# EAGLE design invader_topplate (EAGLE 9.5.0)
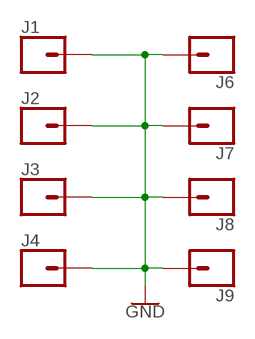
[diagram p0: schematic, sheet 1]

## Parts
J1  CONN_01SPRING-CONN  [SPRING-CONNECTOR]
J2  CONN_01SPRING-CONN  [SPRING-CONNECTOR]
J3  CONN_01SPRING-CONN  [SPRING-CONNECTOR]
J4  CONN_01SPRING-CONN  [SPRING-CONNECTOR]
J6  CONN_01PTH_NO_SILK_KIT  [1X01NS_KIT]
J7  CONN_01PTH_NO_SILK_KIT  [1X01NS_KIT]
J8  CONN_01PTH_NO_SILK_KIT  [1X01NS_KIT]
J9  CONN_01PTH_NO_SILK_KIT  [1X01NS_KIT]

## Nets
GND: J1.P$2 J2.P$2 J3.P$2 J4.P$2 J6.1 J7.1 J8.1 J9.1

## Library data of the parts
J1-J4 = SparkFun-Connectors:CONN_01: Single connection point. Often used as Generic Header-pin footprint for 0.1 inch spaced/style header connections On any of the 0.1 inch spaced packages, you can populate with these: Break Away Headers - Straight <https://www.sparkfun.com/products/116> (PRT-00116) Break Away Male Headers - Right Angle <https://www.sparkfun.com/products/553> (PRT-00553) Female Headers <https://www.sparkfun.com/products/115> (PRT-00115) Break Away Headers - Machine Pin <https://www.sparkfun.com/products/117> (PRT-00117) Break Away Female Headers - Swiss Machine Pin <https://www.sparkfun.com/products/743> (PRT-00743) This device is also useful as a general connection point to wire up your design to another part of your project. Our various solder wires solder well into these plated through hole pads. Hook-Up Wire - Assortment (Stranded, 22 AWG) <https://www.sparkfun.com/products/11375> (PRT-11375) Hook-Up Wire - Assortment (Solid Core, 22 AWG) <https://www.sparkfun.com/products/11367> (PRT-11367) View the entire wire category on our website here <https://www.sparkfun.com/categories/141> Special notes: SMTSO-256-ET is a "flush mount" nut for a 4-40 screw. We mostly use this on specialty testbeds; it is a nice way to connect hardware to your PCB at an adjustable hieght. Also note, the SNAP packages are for using a snappable style connector. We sell a baggie of snaps and they are also used on two LilyPad designs: Snap Assortment - 30 pack (male and female) <https://www.sparkfun.com/products/11347> (DEV-11347) LilyPad Arduino SimpleSnap <https://www.sparkfun.com/products/10941> (DEV-10941) LilyPad SimpleSnap Protoboard <https://www.sparkfun.com/products/10940> (DEV-10940); SF_ID: PRT-11822
J6-J9 = SparkFun-Connectors:CONN_01: Single connection point. Often used as Generic Header-pin footprint for 0.1 inch spaced/style header connections On any of the 0.1 inch spaced packages, you can populate with these: Break Away Headers - Straight <https://www.sparkfun.com/products/116> (PRT-00116) Break Away Male Headers - Right Angle <https://www.sparkfun.com/products/553> (PRT-00553) Female Headers <https://www.sparkfun.com/products/115> (PRT-00115) Break Away Headers - Machine Pin <https://www.sparkfun.com/products/117> (PRT-00117) Break Away Female Headers - Swiss Machine Pin <https://www.sparkfun.com/products/743> (PRT-00743) This device is also useful as a general connection point to wire up your design to another part of your project. Our various solder wires solder well into these plated through hole pads. Hook-Up Wire - Assortment (Stranded, 22 AWG) <https://www.sparkfun.com/products/11375> (PRT-11375) Hook-Up Wire - Assortment (Solid Core, 22 AWG) <https://www.sparkfun.com/products/11367> (PRT-11367) View the entire wire category on our website here <https://www.sparkfun.com/categories/141> Special notes: SMTSO-256-ET is a "flush mount" nut for a 4-40 screw. We mostly use this on specialty testbeds; it is a nice way to connect hardware to your PCB at an adjustable hieght. Also note, the SNAP packages are for using a snappable style connector. We sell a baggie of snaps and they are also used on two LilyPad designs: Snap Assortment - 30 pack (male and female) <https://www.sparkfun.com/products/11347> (DEV-11347) LilyPad Arduino SimpleSnap <https://www.sparkfun.com/products/10941> (DEV-10941) LilyPad SimpleSnap Protoboard <https://www.sparkfun.com/products/10940> (DEV-10940)

## Net classes
0 default: width 0.152 mm
1 VCC: width 0.508 mm

## Board
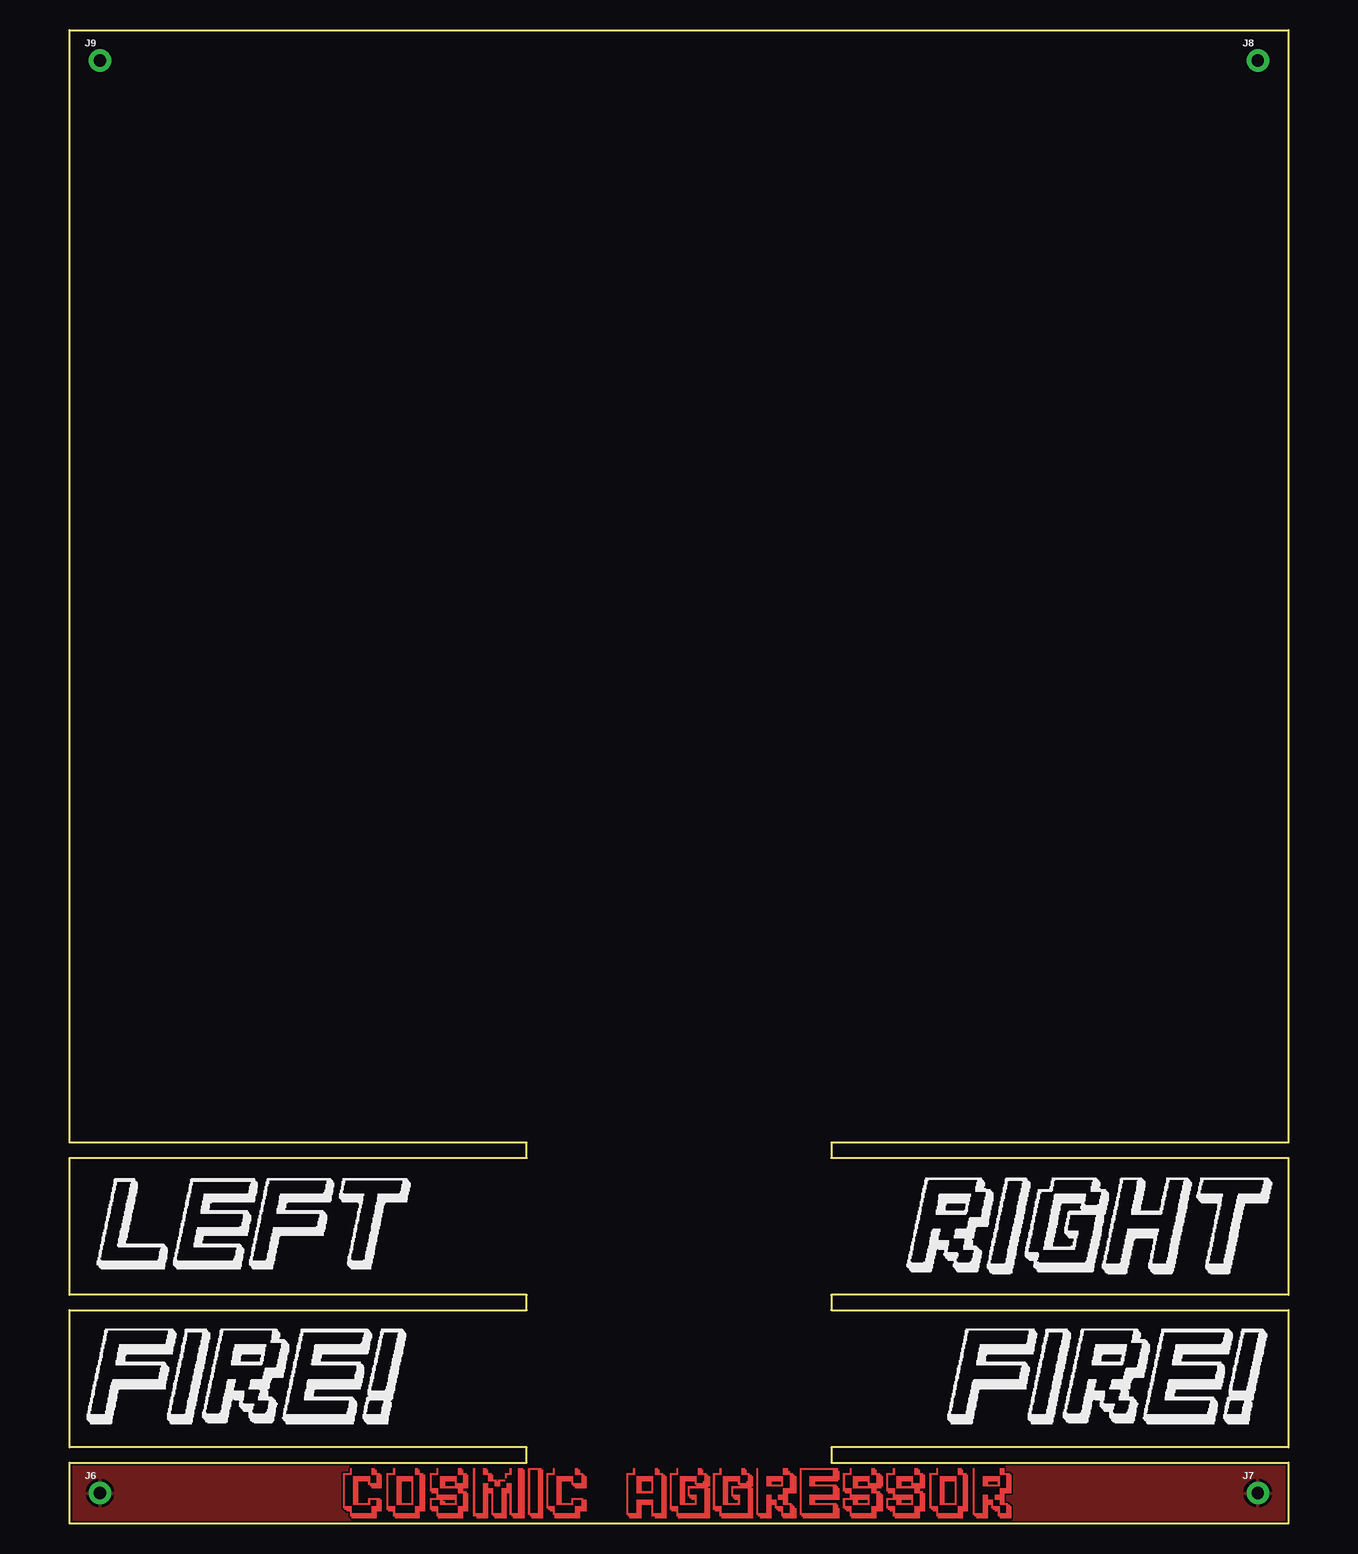
[diagram p1: board, top side]
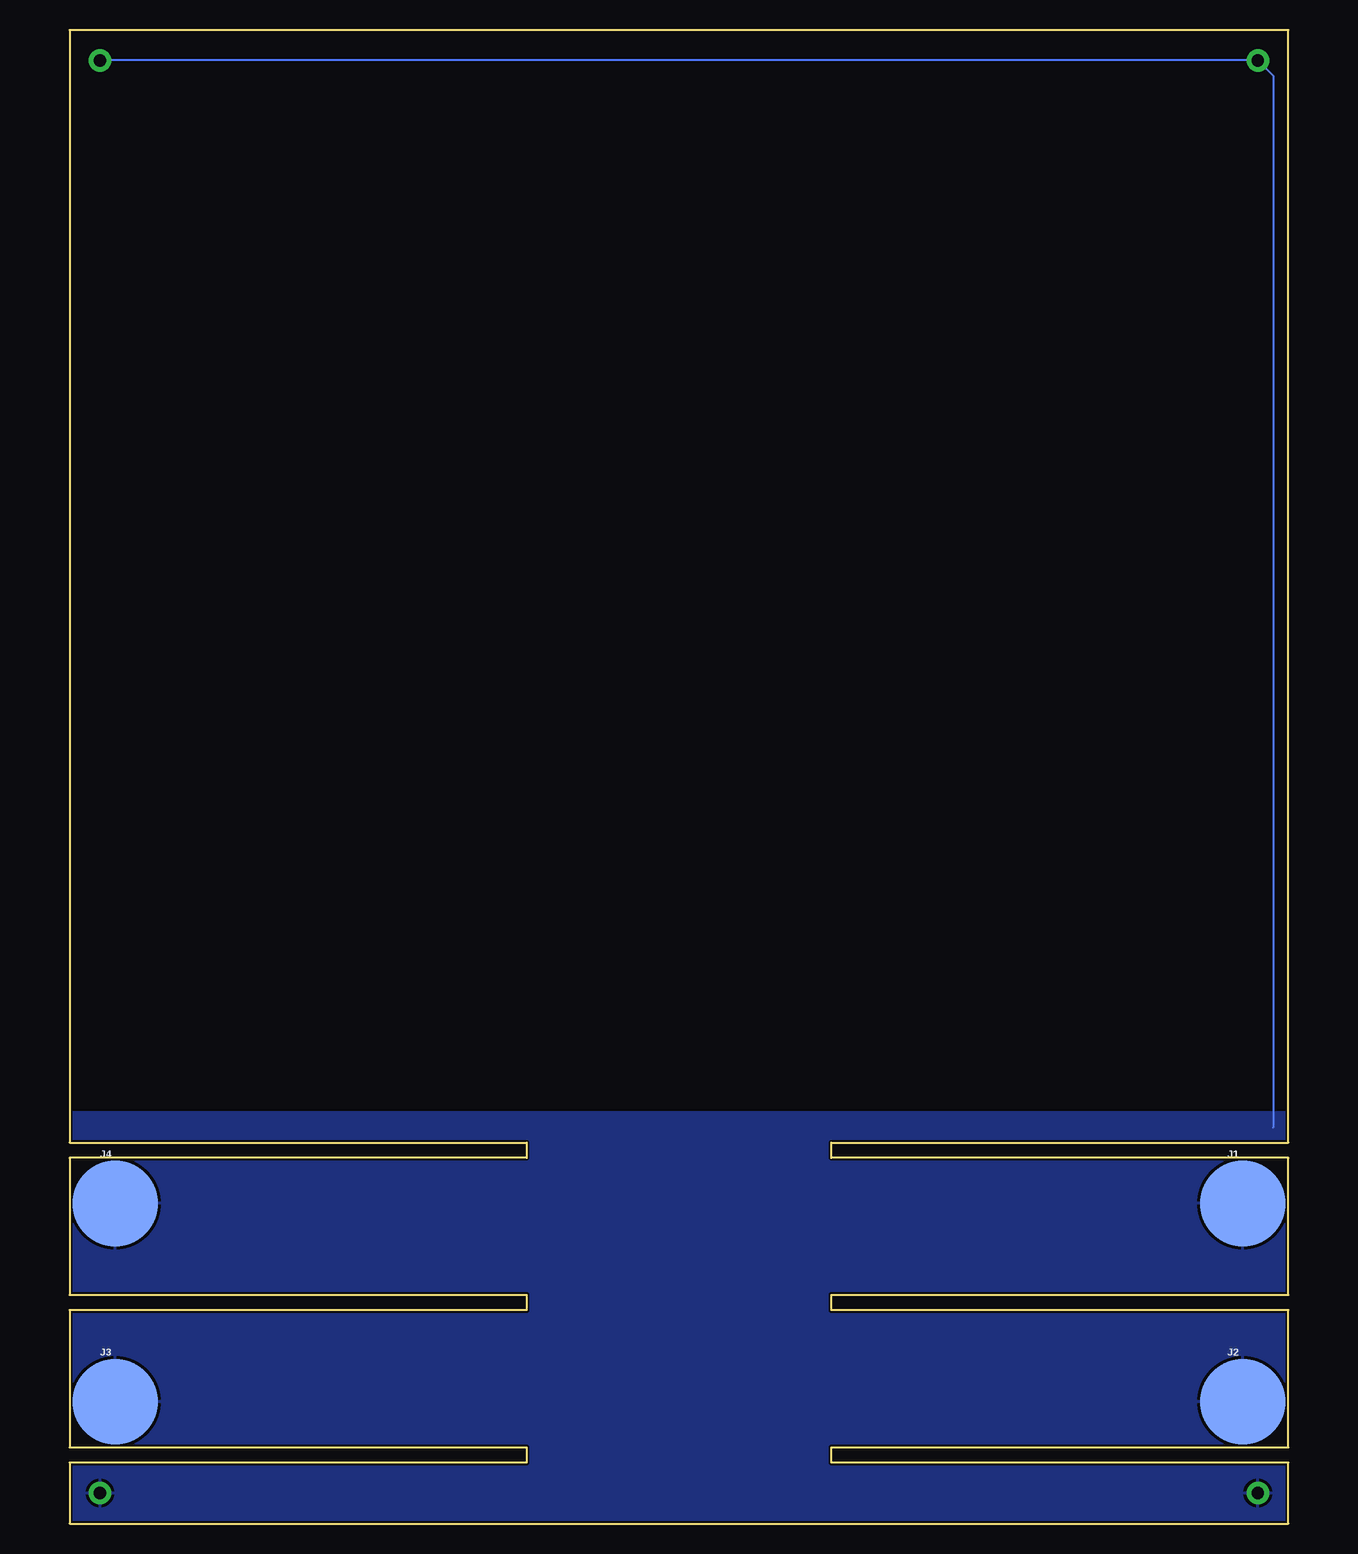
[diagram p2: board, bottom side, seen from below]

Size 101.6 x 124.46 mm. Coordinates in mm from the lower left corner, seen from the top.
Outline: 0,0 0,5.08 38.1,5.08 38.1,6.35 0,6.35 0,17.78 38.1,17.78 38.1,19.05 0,19.05 0,30.48 38.1,30.48 38.1,31.75 0,31.75 0,124.46 101.6,124.46 101.6,31.75 63.5,31.75 63.5,30.48 101.6,30.48 101.6,19.05 63.5,19.05 63.5,17.78 101.6,17.78 101.6,6.35 63.5,6.35 63.5,5.08 101.6,5.08 101.6,0 0,0
Copper layers (1*16): Top 0.035mm / dielectric 1.5mm / Bottom 0.035mm
Design rules "SparkFun-2-layer-PCBWay-LIMIT": minimum track width 6mil, minimum drill 0.3mm, track to track 6mil, track to pad 6mil, pad to pad 6mil, via to via 6mil, smd to smd 6mil, copper to edge 6mil, drill to drill 6mil, minimum pad ring 6mil, minimum via ring 6mil, stop-mask expansion 4mil, vias tented up to drill 25mil, thermal gap 10mil

### Footprints (pad centres in the part's own frame; a part is rotated, then mirrored left to right if it is on the bottom)
SPRING-CONNECTOR = smd 7.112 x 7.112: P$2 0,0
1X01NS_KIT = drill 1.016 pad 1.88: 1 0,0

### Placement (x,y rotation side)
J1  3.81,26.67 0 bottom
J2  3.81,10.16 0 bottom
J3  97.79,10.16 0 bottom
J4  97.79,26.67 0 bottom
J6  2.54,2.54 0 top
J7  99.06,2.54 0 top
J8  99.06,121.92 0 top
J9  2.54,121.92 0 top
U$1  [INVADER_SMALL]  6.35,118.11 0 top
U$2  [FIRE#PNG]  14.61,12.19 0 top
U$3  [INVADER_SMALL]  19.05,118.11 0 top
U$4  [INVADER_SMALL]  6.35,107.95 0 top
U$5  [INVADER_SMALL]  19.05,107.95 0 top
U$6  [INVADER_SMALL]  31.75,107.95 0 top
U$7  [INVADER_SMALL]  44.45,107.95 0 top
U$8  [INVADER_SMALL]  57.15,107.95 0 top
U$9  [INVADER_SMALL]  69.85,107.95 0 top
U$10  [INVADER_SMALL]  82.55,107.95 0 top
U$11  [INVADER_SMALL]  95.25,107.95 0 top
U$12  [BEAM_SMALL]  6.35,102.87 0 top
U$13  [BEAM_SMALL]  19.05,102.87 0 top
U$14  [BEAM_SMALL]  31.75,102.87 0 top
U$15  [BEAM_SMALL]  44.45,102.87 0 top
U$16  [BEAM_SMALL]  57.15,102.87 0 top
U$17  [BEAM_SMALL]  69.85,102.87 0 top
U$18  [BEAM_SMALL]  82.55,102.87 0 top
U$19  [BEAM_SMALL]  95.25,102.87 0 top
U$20  [INVADER_SMALL]  31.75,118.11 0 top
U$21  [INVADER_SMALL]  44.45,118.11 0 top
U$22  [INVADER_SMALL]  57.15,118.11 0 top
U$23  [INVADER_SMALL]  69.85,118.11 0 top
U$24  [INVADER_SMALL]  82.55,118.11 0 top
U$25  [INVADER_SMALL]  95.25,118.11 0 top
U$26  [BEAM_SMALL]  6.35,113.03 0 top
U$27  [BEAM_SMALL]  19.05,113.03 0 top
U$28  [BEAM_SMALL]  31.75,113.03 0 top
U$29  [BEAM_SMALL]  44.45,113.03 0 top
U$30  [BEAM_SMALL]  57.15,113.03 0 top
U$31  [BEAM_SMALL]  69.85,113.03 0 top
U$32  [BEAM_SMALL]  82.55,113.03 0 top
U$33  [BEAM_SMALL]  95.25,113.03 0 top
U$34  [INVADER_SMALL]  6.35,87.63 0 top
U$35  [INVADER_SMALL]  19.05,87.63 0 top
U$36  [INVADER_SMALL]  31.75,87.63 0 top
U$37  [INVADER_SMALL]  44.45,87.63 0 top
U$38  [INVADER_SMALL]  57.15,87.63 0 top
U$39  [INVADER_SMALL]  69.85,87.63 0 top
U$40  [INVADER_SMALL]  82.55,87.63 0 top
U$41  [INVADER_SMALL]  95.25,87.63 0 top
U$42  [BEAM_SMALL]  6.35,82.55 0 top
U$43  [BEAM_SMALL]  19.05,82.55 0 top
U$44  [BEAM_SMALL]  31.75,82.55 0 top
U$45  [BEAM_SMALL]  44.45,82.55 0 top
U$46  [BEAM_SMALL]  57.15,82.55 0 top
U$47  [BEAM_SMALL]  69.85,82.55 0 top
U$48  [BEAM_SMALL]  82.55,82.55 0 top
U$49  [BEAM_SMALL]  95.25,82.55 0 top
U$50  [INVADER_SMALL]  6.35,97.79 0 top
U$51  [INVADER_SMALL]  19.05,97.79 0 top
U$52  [INVADER_SMALL]  31.75,97.79 0 top
U$53  [INVADER_SMALL]  44.45,97.79 0 top
U$54  [INVADER_SMALL]  57.15,97.79 0 top
U$55  [INVADER_SMALL]  69.85,97.79 0 top
U$56  [INVADER_SMALL]  82.55,97.79 0 top
U$57  [INVADER_SMALL]  95.25,97.79 0 top
U$58  [BEAM_SMALL]  6.35,92.71 0 top
U$59  [BEAM_SMALL]  19.05,92.71 0 top
U$60  [BEAM_SMALL]  31.75,92.71 0 top
U$61  [BEAM_SMALL]  44.45,92.71 0 top
U$62  [BEAM_SMALL]  57.15,92.71 0 top
U$63  [BEAM_SMALL]  69.85,92.71 0 top
U$64  [BEAM_SMALL]  82.55,92.71 0 top
U$65  [BEAM_SMALL]  95.25,92.71 0 top
U$66  [INVADER_SMALL]  6.35,67.31 0 top
U$67  [INVADER_SMALL]  19.05,67.31 0 top
U$68  [INVADER_SMALL]  31.75,67.31 0 top
U$69  [INVADER_SMALL]  44.45,67.31 0 top
U$70  [INVADER_SMALL]  57.15,67.31 0 top
U$71  [INVADER_SMALL]  69.85,67.31 0 top
U$72  [INVADER_SMALL]  82.55,67.31 0 top
U$73  [INVADER_SMALL]  95.25,67.31 0 top
U$74  [BEAM_SMALL]  6.35,62.23 0 top
U$75  [BEAM_SMALL]  19.05,62.23 0 top
U$76  [BEAM_SMALL]  31.75,62.23 0 top
U$77  [BEAM_SMALL]  44.45,62.23 0 top
U$78  [BEAM_SMALL]  57.15,62.23 0 top
U$79  [BEAM_SMALL]  69.85,62.23 0 top
U$80  [BEAM_SMALL]  82.55,62.23 0 top
U$81  [BEAM_SMALL]  95.25,62.23 0 top
U$82  [INVADER_SMALL]  6.35,77.47 0 top
U$83  [INVADER_SMALL]  19.05,77.47 0 top
U$84  [INVADER_SMALL]  31.75,77.47 0 top
U$85  [INVADER_SMALL]  44.45,77.47 0 top
U$86  [INVADER_SMALL]  57.15,77.47 0 top
U$87  [INVADER_SMALL]  69.85,77.47 0 top
U$88  [INVADER_SMALL]  82.55,77.47 0 top
U$89  [INVADER_SMALL]  95.25,77.47 0 top
U$90  [BEAM_SMALL]  6.35,72.39 0 top
U$91  [BEAM_SMALL]  19.05,72.39 0 top
U$92  [BEAM_SMALL]  31.75,72.39 0 top
U$93  [BEAM_SMALL]  44.45,72.39 0 top
U$94  [BEAM_SMALL]  57.15,72.39 0 top
U$95  [BEAM_SMALL]  69.85,72.39 0 top
U$96  [BEAM_SMALL]  82.55,72.39 0 top
U$97  [BEAM_SMALL]  95.25,72.39 0 top
U$98  [INVADER_SMALL]  6.35,46.99 0 top
U$99  [INVADER_SMALL]  19.05,46.99 0 top
U$100  [INVADER_SMALL]  31.75,46.99 0 top
U$101  [INVADER_SMALL]  44.45,46.99 0 top
U$102  [INVADER_SMALL]  57.15,46.99 0 top
U$103  [INVADER_SMALL]  69.85,46.99 0 top
U$104  [INVADER_SMALL]  82.55,46.99 0 top
U$105  [INVADER_SMALL]  95.25,46.99 0 top
U$106  [BEAM_SMALL]  6.35,41.91 0 top
U$107  [BEAM_SMALL]  19.05,41.91 0 top
U$108  [BEAM_SMALL]  31.75,41.91 0 top
U$109  [BEAM_SMALL]  44.45,41.91 0 top
U$110  [BEAM_SMALL]  57.15,41.91 0 top
U$111  [BEAM_SMALL]  69.85,41.91 0 top
U$112  [BEAM_SMALL]  82.55,41.91 0 top
U$113  [BEAM_SMALL]  95.25,41.91 0 top
U$114  [INVADER_SMALL]  6.35,57.15 0 top
U$115  [INVADER_SMALL]  19.05,57.15 0 top
U$116  [INVADER_SMALL]  31.75,57.15 0 top
U$117  [INVADER_SMALL]  44.45,57.15 0 top
U$118  [INVADER_SMALL]  57.15,57.15 0 top
U$119  [INVADER_SMALL]  69.85,57.15 0 top
U$120  [INVADER_SMALL]  82.55,57.15 0 top
U$121  [INVADER_SMALL]  95.25,57.15 0 top
U$122  [BEAM_SMALL]  6.35,52.07 0 top
U$123  [BEAM_SMALL]  19.05,52.07 0 top
U$124  [BEAM_SMALL]  31.75,52.07 0 top
U$125  [BEAM_SMALL]  44.45,52.07 0 top
U$126  [BEAM_SMALL]  57.15,52.07 0 top
U$127  [BEAM_SMALL]  69.85,52.07 0 top
U$128  [BEAM_SMALL]  82.55,52.07 0 top
U$129  [BEAM_SMALL]  95.25,52.07 0 top
U$130  [BLASTER_SMALL]  6.35,36.83 0 top
U$131  [BLASTER_SMALL]  19.05,36.83 0 top
U$132  [BLASTER_SMALL]  31.75,36.83 0 top
U$133  [BLASTER_SMALL]  44.45,36.83 0 top
U$134  [BLASTER_SMALL]  57.15,36.83 0 top
U$135  [BLASTER_SMALL]  69.85,36.83 0 top
U$136  [BLASTER_SMALL]  82.55,36.83 0 top
U$137  [BLASTER_SMALL]  95.25,36.83 0 top
U$138  [FIRE#PNG]  86.36,12.19 0 top
U$139  [LEFT#PNG]  15.24,24.89 0 top
U$140  [RIGHT#PNG]  85.09,24.77 0 top
U$141  [TITLE#PNG]  50.8,2.54 0 top

### Tracks (layer width: path | path; a pad name or v marks a point on that pad's centre or on a via)
GND
  Bottom 0.152: J8.1 J9.1 1.27,120.65 1.27,33.02
  pour Bottom: 0,34.29 101.6,34.29 101.6,0 0,0
  pour Top: 0,0 0,5.08 0,21.59 0,31.75 0,34.29 101.6,34.29 101.6,31.75 101.6,5.08 101.6,0